# Altium schematic sheet leo_MCU.SchDoc
size 510 x 400 mm; SheetNumber: 2; SheetTotal: 5
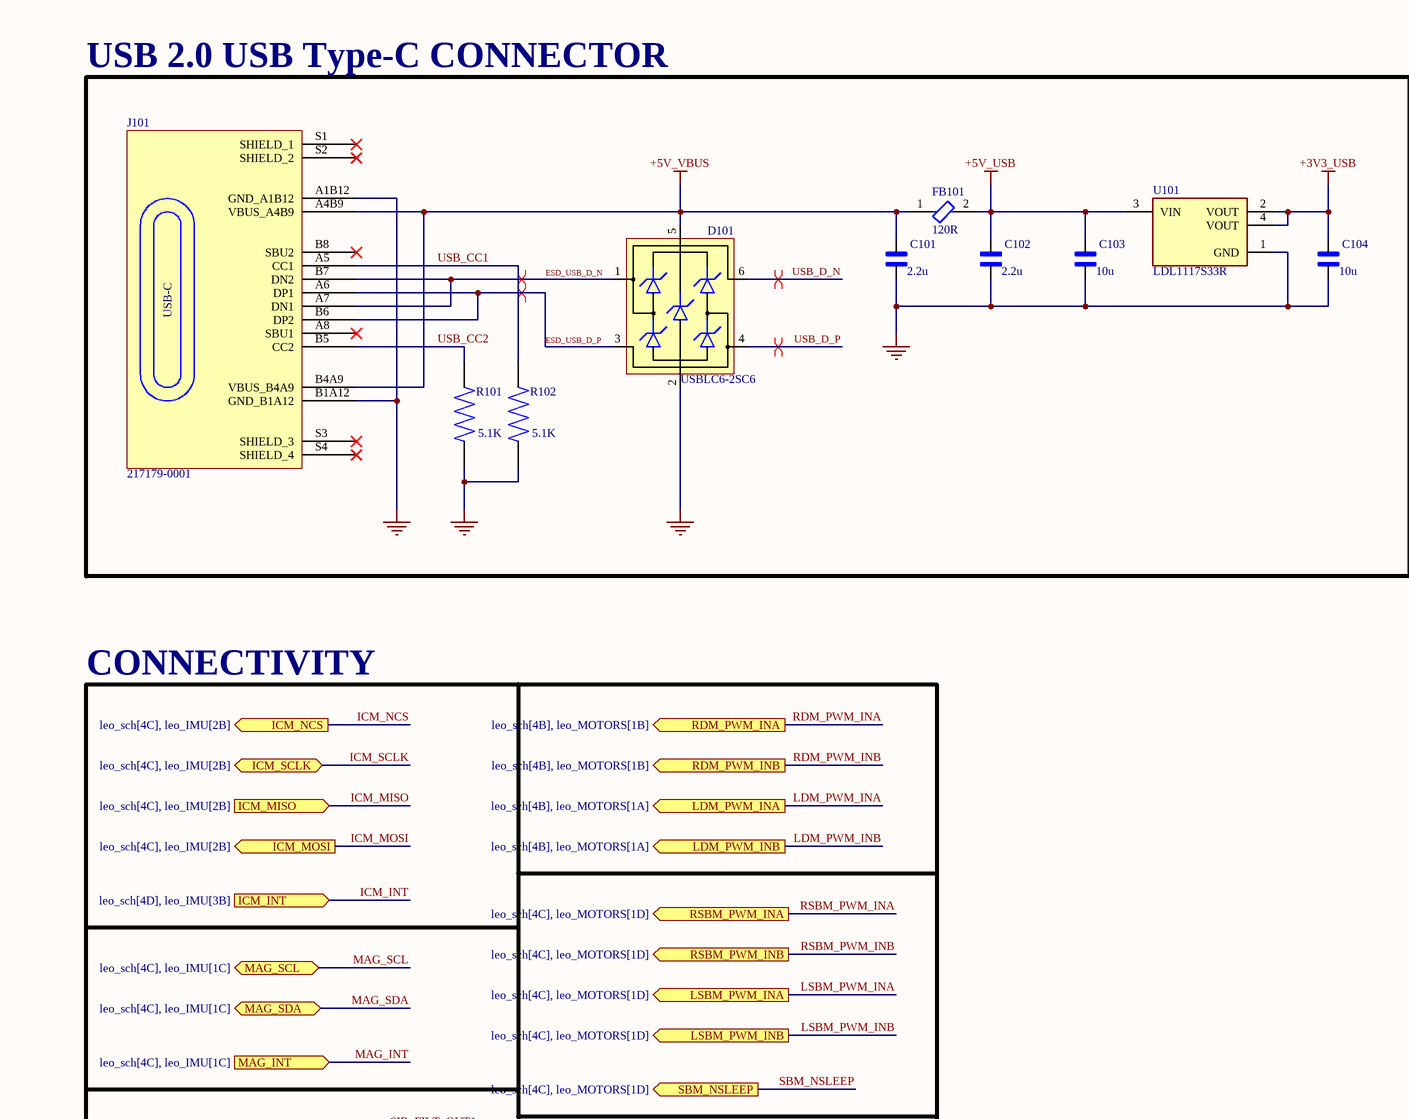
[diagram p0: leo_MCU.SchDoc, top left]
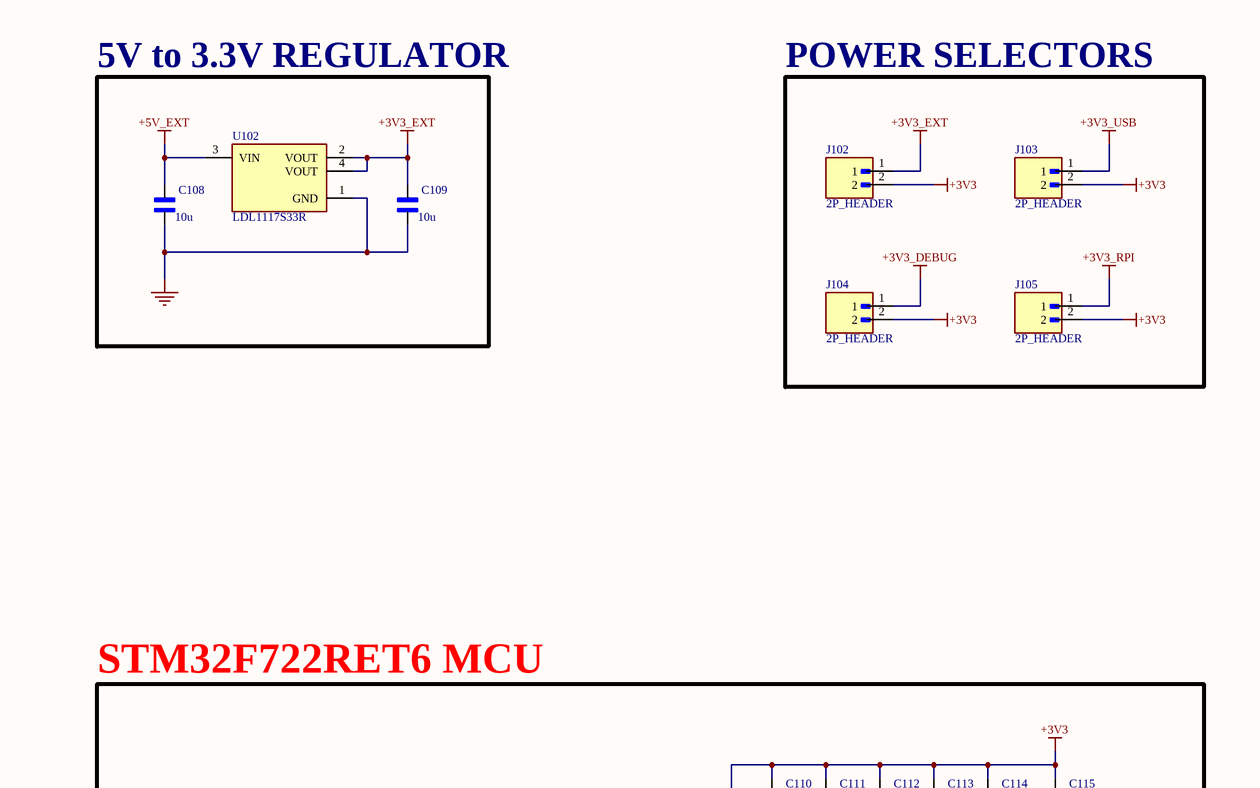
[diagram p1: leo_MCU.SchDoc, top right]
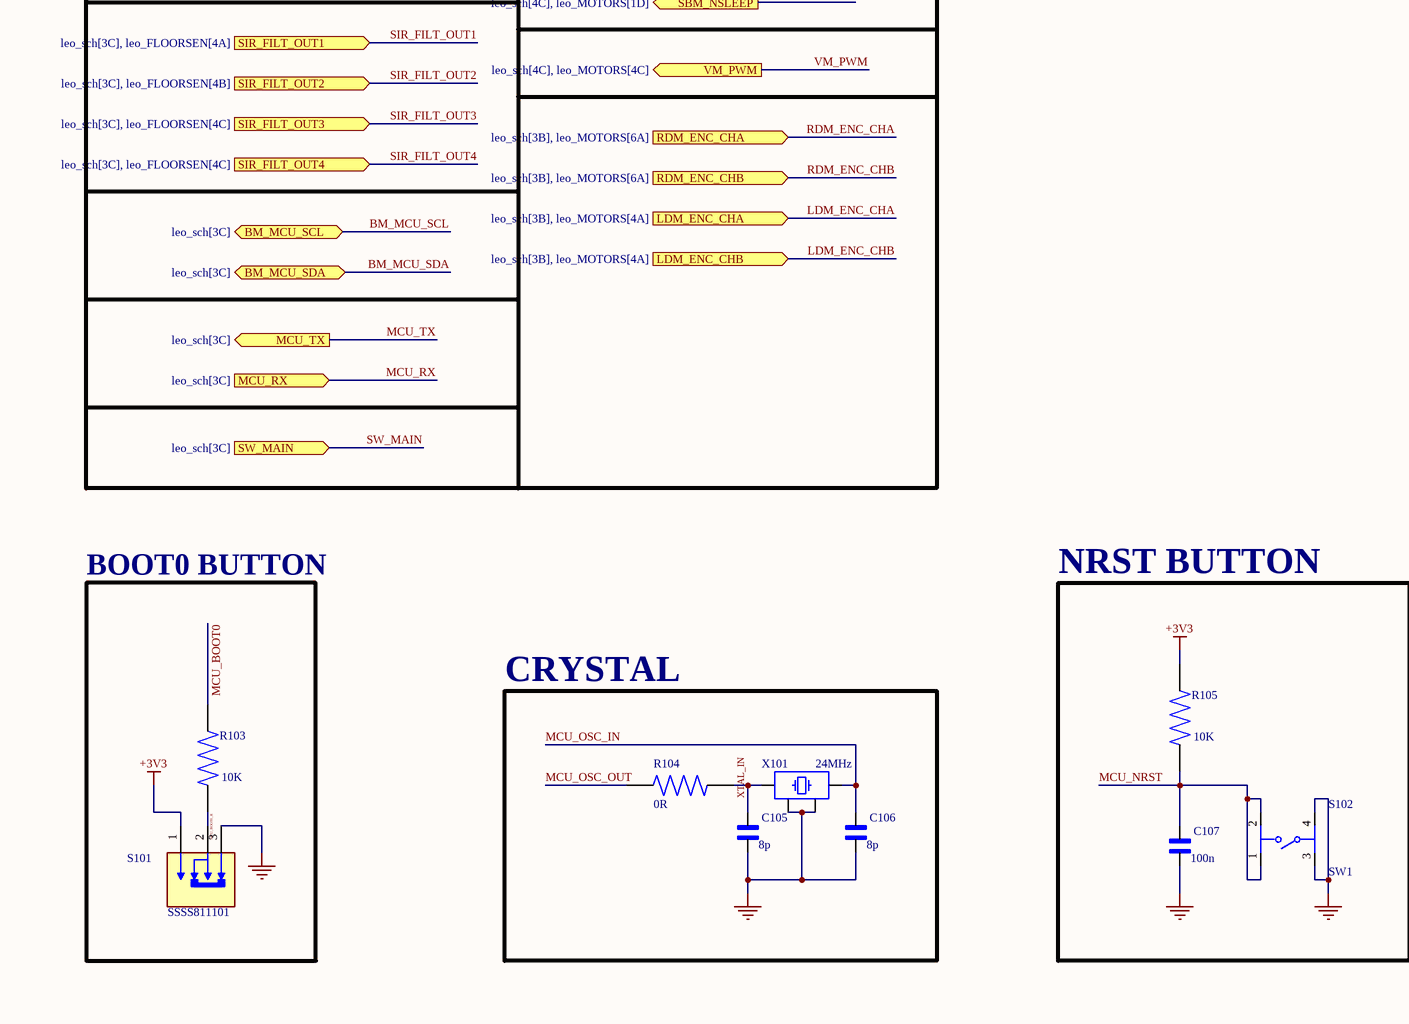
[diagram p2: leo_MCU.SchDoc, bottom left]
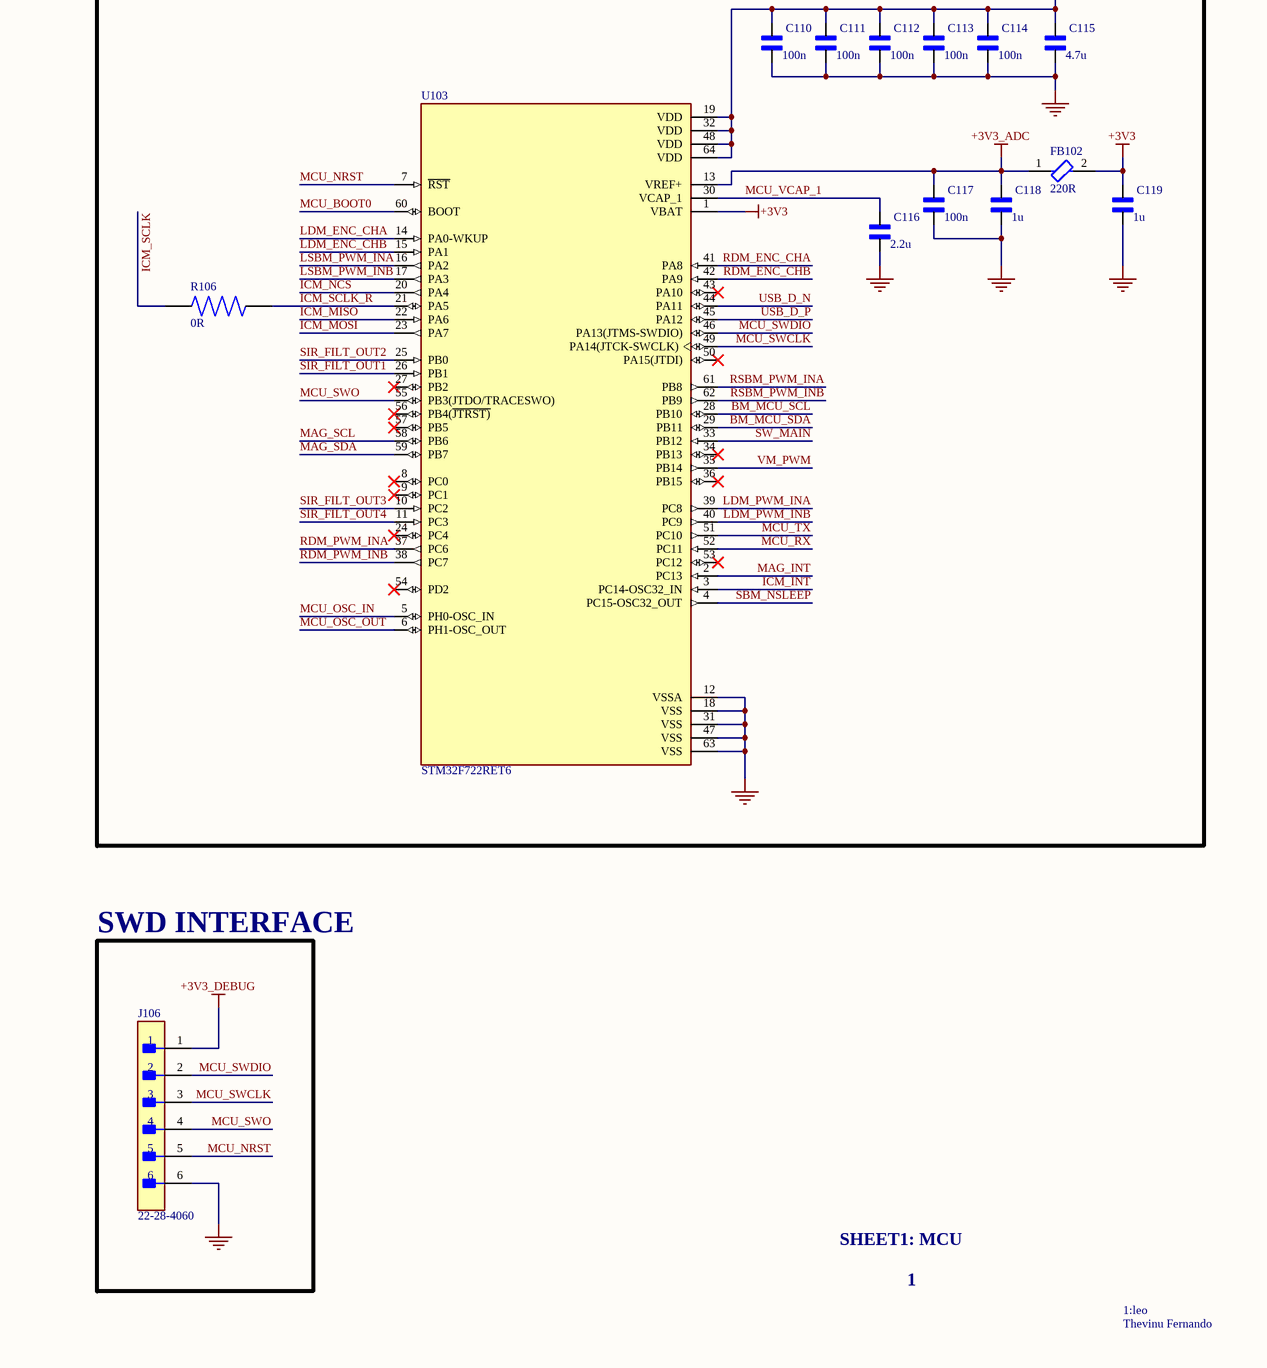
[diagram p3: leo_MCU.SchDoc, bottom right]

## Parts
C101  2.2u  [CAP_0603]
C102  2.2u  [CAP_0603]
C103  10u  [CAP_0805]
C104  10u  [CAP_0805]
C105  8p  [CAP_0402]
C106  8p  [CAP_0402]
C107  100n  [CAP_0402]
C108  10u  [CAP_0805]
C109  10u  [CAP_0805]
C110  100n  [CAP_0402]
C111  100n  [CAP_0402]
C112  100n  [CAP_0402]
C113  100n  [CAP_0402]
C114  100n  [CAP_0402]
C115  4.7u  [CAP_0603]
C116  2.2u  [CAP_0603]
C117  100n  [CAP_0402]
C118  1u  [CAP_0603]
C119  1u  [CAP_0603]
D101  USBLC6-2SC6  [SOT95P280X145-6N]
FB101  120R  [FP-MPZ1608-0_8-IPC_B]
FB102  220R  [FP-MPZ1608-0_8-IPC_B]
J101  217179-0001  [FP-2171790001-MFG USB-C 2.0]
J102  2P_HEADER  [HARWIN_M20-9990246 2P Header]
J103  2P_HEADER  [HARWIN_M20-9990246 2P Header]
J104  2P_HEADER  [HARWIN_M20-9990246 2P Header]
J105  2P_HEADER  [HARWIN_M20-9990246 2P Header]
J106  22-28-4060  [FP-22-28-4060-MFG]
R101  5.1K  [RES_0402]
R102  5.1K  [RES_0402]
R103  10K  [RES_0402]
R104  0R  [RES_0402]
R105  10K  [RES_0402]
R106  0R  [RES_0402]
S101  SSSS811101  [SW_SSSS811101]
S102  SW1  [FP-PTS645SM43SMTR92LFS-MFG]
U101  LDL1117S33R  [FP-SOT223-0046067-IPC_A]
U102  LDL1117S33R  [FP-SOT223-0046067-IPC_A]
U103  STM32F722RET6  [FP-LQFP64-5W-IPC_B]
X101  24MHz  [XTAL_3225]

## Blocks framed on the sheet
USB 2.0 USB Type-C CONNECTOR: C101-C104 D101 FB101 J101 R101 R102 U101
5V to 3.3V REGULATOR: C108 C109 U102
POWER SELECTORS: J102-J105
STM32F722RET6 MCU: C110-C119 FB102 R106 U103
BOOT0 BUTTON: R103 S101
NRST BUTTON: C107 R105 S102
SWD INTERFACE: J106
CRYSTAL: C105 C106 R104 X101

## Ports
BM_MCU_SCL (bidir, see leo_sch[3C]), BM_MCU_SDA (bidir, see leo_sch[3C]), ICM_INT (in, see leo_sch[4D], leo_IMU[3B]), ICM_MISO (in, see leo_sch[4C], leo_IMU[2B]), ICM_MOSI (out, see leo_sch[4C], leo_IMU[2B]), ICM_NCS (out, see leo_sch[4C], leo_IMU[2B]), ICM_SCLK (bidir, see leo_sch[4C], leo_IMU[2B]), LDM_ENC_CHA (in, see leo_sch[3B], leo_MOTORS[4A]), LDM_ENC_CHB (in, see leo_sch[3B], leo_MOTORS[4A]), LDM_PWM_INA (out, see leo_sch[4B], leo_MOTORS[1A]), LDM_PWM_INB (out, see leo_sch[4B], leo_MOTORS[1A]), LSBM_PWM_INA (out, see leo_sch[4C], leo_MOTORS[1D]), LSBM_PWM_INB (out, see leo_sch[4C], leo_MOTORS[1D]), MAG_INT (in, see leo_sch[4C], leo_IMU[1C]), MAG_SCL (bidir, see leo_sch[4C], leo_IMU[1C]), MAG_SDA (bidir, see leo_sch[4C], leo_IMU[1C]), MCU_RX (in, see leo_sch[3C]), MCU_TX (out, see leo_sch[3C]), RDM_ENC_CHA (in, see leo_sch[3B], leo_MOTORS[6A]), RDM_ENC_CHB (in, see leo_sch[3B], leo_MOTORS[6A]), RDM_PWM_INA (out, see leo_sch[4B], leo_MOTORS[1B]), RDM_PWM_INB (out, see leo_sch[4B], leo_MOTORS[1B]), RSBM_PWM_INA (out, see leo_sch[4C], leo_MOTORS[1D]), RSBM_PWM_INB (out, see leo_sch[4C], leo_MOTORS[1D]), SBM_NSLEEP (out, see leo_sch[4C], leo_MOTORS[1D]), SIR_FILT_OUT1 (in, see leo_sch[3C], leo_FLOORSEN[4A]), SIR_FILT_OUT2 (in, see leo_sch[3C], leo_FLOORSEN[4B]), SIR_FILT_OUT3 (in, see leo_sch[3C], leo_FLOORSEN[4C]), SIR_FILT_OUT4 (in, see leo_sch[3C], leo_FLOORSEN[4C]), SW_MAIN (in, see leo_sch[3C]), VM_PWM (out, see leo_sch[4C], leo_MOTORS[4C])

## Nets
+3V3: C110.2 C111.2 C112.2 C113.2 C114.2 C115.2 C119.2 FB102.2 J102.2 J103.2 J104.2 J105.2 R105.2 S101.1 U103.1(VBAT) U103.19(VDD) U103.32(VDD) U103.48(VDD) U103.64(VDD)
+3V3_ADC: C117.2 C118.2 FB102.1 U103.13(VREF+)
+3V3_DEBUG: J104.1 J106.1
+3V3_EXT: C109.1 J102.1 U102.2(VOUT) U102.4(VOUT)
+3V3_RPI: J105.1
+3V3_USB: C104.1 J103.1 U101.2(VOUT) U101.4(VOUT)
+5V_EXT: C108.1 U102.3(VIN)
+5V_USB: C102.2 C103.1 FB101.2 U101.3(VIN)
+5V_VBUS: C101.2 D101.5(VBUS) FB101.1 J101.A4B9(VBUS_A4B9) J101.B4A9(VBUS_B4A9)
GND: C101.1 C102.1 C103.2 C104.2 C105.1 C106.1 C107.1 C108.2 C109.2 C110.1 C111.1 C112.1 C113.1 C114.1 C115.1 C116.1 C117.1 C118.1 C119.1 D101.2(GND) J101.A1B12(GND_A1B12) J101.B1A12(GND_B1A12) J106.6 R101.2 R102.2 S101.3 S102.3 S102.4 U101.1(GND) U102.1(GND) U103.12(VSSA) U103.18(VSS) U103.31(VSS) U103.47(VSS) U103.63(VSS) X101.2 X101.4
BM_MCU_SCL: U103.28(PB10) ; port BM_MCU_SCL
BM_MCU_SDA: U103.29(PB11) ; port BM_MCU_SDA
ESD_USB_D_N: D101.1(IO1) J101.A7(DN1) J101.B7(DN2)
ESD_USB_D_P: D101.3(IO2) J101.A6(DP1) J101.B6(DP2)
ICM_INT: U103.3(PC14-OSC32_IN) ; port ICM_INT
ICM_MISO: U103.22(PA6) ; port ICM_MISO
ICM_MOSI: U103.23(PA7) ; port ICM_MOSI
ICM_NCS: U103.20(PA4) ; port ICM_NCS
ICM_SCLK: R106.2 ; port ICM_SCLK
ICM_SCLK_R: R106.1 U103.21(PA5)
LDM_ENC_CHA: U103.14(PA0-WKUP) ; port LDM_ENC_CHA
LDM_ENC_CHB: U103.15(PA1) ; port LDM_ENC_CHB
LDM_PWM_INA: U103.39(PC8) ; port LDM_PWM_INA
LDM_PWM_INB: U103.40(PC9) ; port LDM_PWM_INB
LSBM_PWM_INA: U103.16(PA2) ; port LSBM_PWM_INA
LSBM_PWM_INB: U103.17(PA3) ; port LSBM_PWM_INB
MAG_INT: U103.2(PC13) ; port MAG_INT
MAG_SCL: U103.58(PB6) ; port MAG_SCL
MAG_SDA: U103.59(PB7) ; port MAG_SDA
MCU_BOOT0: R103.2 U103.60(BOOT)
MCU_BOOT0_R: R103.1 S101.2
MCU_NRST: C107.2 J106.5 R105.1 S102.1 S102.2 U103.7(~{RST})
MCU_OSC_IN: C106.2 U103.5(PH0-OSC_IN) X101.3
MCU_OSC_OUT: R104.2 U103.6(PH1-OSC_OUT)
MCU_RX: U103.52(PC11) ; port MCU_RX
MCU_SWCLK: J106.3 U103.49(PA14(JTCK-SWCLK))
MCU_SWDIO: J106.2 U103.46(PA13(JTMS-SWDIO))
MCU_SWO: J106.4 U103.55(PB3(JTDO/TRACESWO))
MCU_TX: U103.51(PC10) ; port MCU_TX
MCU_VCAP_1: C116.2 U103.30(VCAP_1)
RDM_ENC_CHA: U103.41(PA8) ; port RDM_ENC_CHA
RDM_ENC_CHB: U103.42(PA9) ; port RDM_ENC_CHB
RDM_PWM_INA: U103.37(PC6) ; port RDM_PWM_INA
RDM_PWM_INB: U103.38(PC7) ; port RDM_PWM_INB
RSBM_PWM_INA: U103.61(PB8) ; port RSBM_PWM_INA
RSBM_PWM_INB: U103.62(PB9) ; port RSBM_PWM_INB
SBM_NSLEEP: U103.4(PC15-OSC32_OUT) ; port SBM_NSLEEP
SIR_FILT_OUT1: U103.26(PB1) ; port SIR_FILT_OUT1
SIR_FILT_OUT2: U103.25(PB0) ; port SIR_FILT_OUT2
SIR_FILT_OUT3: U103.10(PC2) ; port SIR_FILT_OUT3
SIR_FILT_OUT4: U103.11(PC3) ; port SIR_FILT_OUT4
SW_MAIN: U103.33(PB12) ; port SW_MAIN
USB_CC1: J101.A5(CC1) R102.1
USB_CC2: J101.B5(CC2) R101.1
USB_D_N: D101.6(IO1) U103.44(PA11)
USB_D_P: D101.4(IO2) U103.45(PA12)
VM_PWM: U103.35(PB14) ; port VM_PWM
XTAL_IN: C105.2 R104.1 X101.1

Not connected (* = marked no-connect by the designer): J101 A8(SBU1)* B8(SBU2)* S1(SHIELD_1)* S2(SHIELD_2)* S3(SHIELD_3)* S4(SHIELD_4)*; U103 8(PC0)* 9(PC1)* 24(PC4)* 27(PB2)* 34(PB13)* 36(PB15)* 43(PA10)* 50(PA15(JTDI))* 53(PC12)* 54(PD2)* 56(PB4(~{JTRST)})* 57(PB5)*

## Layout directives
differential pair; differential pair class ESD_DIFF_USB: ESD_USB_D_N, ESD_USB_D_P
differential pair; differential pair class DIFF_USB: USB_D_N, USB_D_P

## Notes on the sheet
- CONNECTIVITY
- SHEET1: MCU
- 1
- 1:leo
- Thevinu Fernando
- (in symbol USB_Connector) USB-C

## Library data of the parts
C101 C102 C115 C116 C118 C119 = CAP_0603: Ceramic Capacitor X5R 0603 (1608 Metric); MF: Samsung Electro-Mechanics; MP: CL10A475KO8NNNC; SnapEDA_Link: https://www.snapeda.com/parts/CL10A475KO8NNNC/Samsung/view-part/?ref=snap; Package: SMD-2 Samsung; Value: *; Check_prices: https://www.snapeda.com/parts/CL10A475KO8NNNC/Samsung/view-part/?ref=eda
C103 C104 C108 C109 = CAP_0805: Ceramic Capacitor X7R 0805 (2012 Metric); MF: Samsung Electro-Mechanics; MP: CL21B106KOQNNNE; SnapEDA_Link: https://www.snapeda.com/parts/CL21B106KOQNNNE/Samsung+Electro-Mechanics/view-part/?ref=snap; Package: 0805 Samsung; Value: *; Check_prices: https://www.snapeda.com/parts/CL21B106KOQNNNE/Samsung+Electro-Mechanics/view-part/?ref=eda
C105-C107 C110-C114 C117 = CAP_0402: Ceramic Capacitor X7R 0402 (1005 Metric); MF: Samsung; MP: CL05B104KO5NNNC; SnapEDA_Link: https://www.snapeda.com/parts/CL05B104KO5NNNC/Samsung/view-part/?ref=snap; Package: SMD-2 Samsung; Value: *; Check_prices: https://www.snapeda.com/parts/CL05B104KO5NNNC/Samsung/view-part/?ref=eda
D101 = USBLC6-2SC6: Low-Capacitance ESD Protection USB; Manufacturer: STMicroelectronics; Manufacturer Part Number: USBLC6-2SC6; Distributor Link: https://www.mouser.de/ProductDetail/STMicroelectronics/USBLC6-2SC6?qs=po45yt2pPpu%2FhNIlwQdTlg%3D%3D
FB101 = Ferrite_Bead_120R_0603: 120Ω@100MHz 1 Line Ferrite Bead 0603 3A 30mΩ; DC Resistance (DCR): 30mR; Number of Lines: 1; Test Frequency: 100MHz; Tolerance: 25%; Max Current Rating: 3A; Package Quantity: 4000; Min Operating Temperature: -55°C; Termination: SMD/SMT; REACH SVHC: No SVHC; Core Material: Ferrite; Material: Ferrite; Current Rating: 3A; Impedance: 120R; Height: 0.8mm; Number of Pins: 2; Case/Package: 0603; Case Code (Imperial): 0603; Series: BLM18K; Packaging: Tape and Reel; Inductor Type: FERRITE BEAD; Lead Free: Lead Free; Width: 0.8mm; Case Code (Metric): 1608; Number of Circuits: 1; Max DC Current: 3A; Depth: 0.95mm; Max Operating Temperature: 125°C; Length: 1.6mm; RoHS Compliant: Yes
FB102 = Ferrite_Bead_0603: Power line Ferrite Bead 220Ω @ 100MHz 2.2A DCR 0.05Ω SMD 0603; DC Resistance (DCR): 50mR; Tolerance: 25%; Series: MPZ; Width: 0.031inch; REACH SVHC: No SVHC; Case Code (Imperial): 0603; Current Rating: 2.2A; Case/Package: 0603; Packaging: Cut Tape; Height: 0.037inch; Number of Pins: 2; Max DC Current: 2.2A; Lead Free: Lead Free; RoHS Compliant: Yes; Mount: Surface Mount; Case Code (Metric): 1608; Length: 0.063inch; Package Quantity: 1; Impedance: 220R; Core Material: Ferrite
J101 = USB_Connector: USB 2.0 5A 1 16P -40℃~+85℃ SMD USB, DVI, HDMI Connector Assemblies RoHS; Manufacturer: Molex; Supplier: Digikey; Supplier Part Number: 900-2171790001CT-ND; Manufacturer Part Number: 217179-0001; RoHS: No; Category: Connectors; Stock: 7228; Pricing: 1=0.9, 10=0.745, 100=0.6212 (USD); LCSC Part Number: C3197684
J102-J105 = 2P_HEADER: 2.54mm (0.1) Pitch SIL Vertical Throughboard Pin Header, 6.1mm mating pin height, tin, 2 contacts; MF: Harwin; MP: M20-9990246; SnapEDA_Link: https://www.snapeda.com/parts/M20-9990246/Harwin/view-part/?ref=snap; Package: None; Value: *; Check_prices: https://www.snapeda.com/parts/M20-9990246/Harwin/view-part/?ref=eda
J106 = 6P_M_HEADER: CONN HEADER VERT 6POS 2.54MM; Voltage Rating: 250V; Current Rating: 4A; Number of Contacts: 6; Max Voltage Rating (DC): 250.25kV; Gender: Male; Contact Resistance: 20mR; Connector Type: Male Pin; Color: Black; Max Voltage Rating (AC): 250V; Pitch: 2.54mm; Orientation: Straight; Max Operating Temperature: 75°C; Contact Plating: Tin; Depth: 2.49mm; Contact Type: Male Pin; Number of Positions: 6; Length: 15.24mm; Packaging: Bulk; Mount: Through Hole; Housing Material: Thermoplastic; Housing Color: Black; Termination: Solder; Contact Material: Brass; Min Operating Temperature: 0°C; Series: KK® 42375; Number of Rows: 1; Package Quantity: 1; RoHS Compliant: Yes; Contact Mating Length: 0.24inch
R101-R106 = RES_0402: Chip Resistor 0402 (1005 Metric) Automotive AEC-Q200 Thick Film; MF: Panasonic; MP: ERJ-2RKF1002X; Package: 1005-2 Panasonic; Price: None; Check_prices: https://www.snapeda.com/parts/ERJ-2RKF1002X/Panasonic%20Electronic%20Components/view-part/78636/?ref=eda; Value: *; SnapEDA_Link: https://www.snapeda.com/parts/ERJ-2RKF1002X/Panasonic%20Electronic%20Components/view-part/78636/?ref=snap; Availability: In Stock
S101 = SSSS811101: Switch Slide SP Side Slide 0.3A 5VDC 10000Cycles Gull Wing SMD T/R; MF: ALPS; SnapEDA_Link: https://www.snapeda.com/parts/SSSS811101/ALPS/view-part/?ref=snap; Package: None; Value: *; MP: SSSS811101; Check_prices: https://www.snapeda.com/parts/SSSS811101/ALPS/view-part/?ref=eda
S102 = PTS645SM43SMTR92LFS: Tactile Switch SPST 160gf 4.3mm Gull Wing 6mm x 6mm Surface Mount; Contact Resistance: 100mR; Illumination Type: Non-Illuminated; Mechanical Life: 100000Cycles; Voltage Rating (DC): 12V; Current Rating: 50mA; Switch Function: Off-Mom; Actuator Length: 0.85mm; Actuator Material: Nylon; Actuator Type: Standard; Min Operating Temperature: -20°C; REACH SVHC: No SVHC; Termination: Gull Wing; Throw Configuration: SPST; Case/Package: SMD/SMT; Packaging: Tape and Reel; Mount: Surface Mount; Orientation: Straight; Lead Free: Lead Free; Contact Material: Silver; Color: Black; Max Current Rating: 50mA; Contact Plating: Silver; Depth: 9mm; Package Quantity: 1; Max Voltage Rating (DC): 12V; Operating Force: 160gf; Length: 6mm; Max Operating Temperature: 60°C
U101 U102 = LDO_LDL1117S33R: IC REG LINEAR 3.3V 1.2A SOT223; Manufacturer: STMicroelectronics; Output Type: Fixed; Min Supply Voltage: 2.6V; Number Of Outputs: 1; Dropout Voltage: 350mV; Output Current: 2A; Nominal Supply Current: 250uA; Standoff Height: 0.02mm; Max Supply Voltage: 18V; Max Junction Temp: +125°C; Accuracy Percentage: 2%; Automotive: No; Device Class L2: Power Management ICs; Height: 1.9mm; Octopart: https://octopart.com/ldl1117s33r-stmicroelectronics-81876163; Output Voltage: 3.3V; Package: SOT223-0046067; Lead Free: Yes; Temperature Range Low: -40°C; Category: IC; Device Class L1: Integrated Circuits (ICs); Ipc Land Pattern Name: SOT230P700X190-4; Mouser Description: LDL1117 Series 1.2 A 3.3 V High PSRR LDO Linear Voltage Regulator-SOT-223; ComponentLink2Description: Datasheet; ComponentLink2URL: https://www.st.com/resource/en/datasheet/ldl1117.pdf; Device Class L3: Voltage Regulators - Linear; Manufacturer Part Number: LDL1117S33R; Temperature Range High: +125°C; Digikey Description: IC REG LINEAR 3.3V 1.2A SOT223; Temperature: -40°C to +125°C; RoHS: TRUE
U103 = STM32F722RET6: ARM Cortex-M7 32 Bit 216MHz 50 LQFP-64(10x10) Microcontrollers RoHS; MF: STMicroelectronics; SnapEDA_Link: https://www.snapeda.com/parts/STM32F722RET6/STMicroelectronics/view-part/?ref=snap; Package: LQFP-64 STMicroelectronics; Value: *; MP: STM32F722RET6; Check_prices: https://www.snapeda.com/parts/STM32F722RET6/STMicroelectronics/view-part/?ref=eda
X101 = TSX-3225_24.0000MF15X-AC: Crystal SMD 24MHz 10PPM 7pF 3225; Manufacturer: Epson; Manufacturer Part Number: TSX-3225 24.0000MF15X-AC